# EAGLE schematic RGBtlc (EAGLE 6.2)
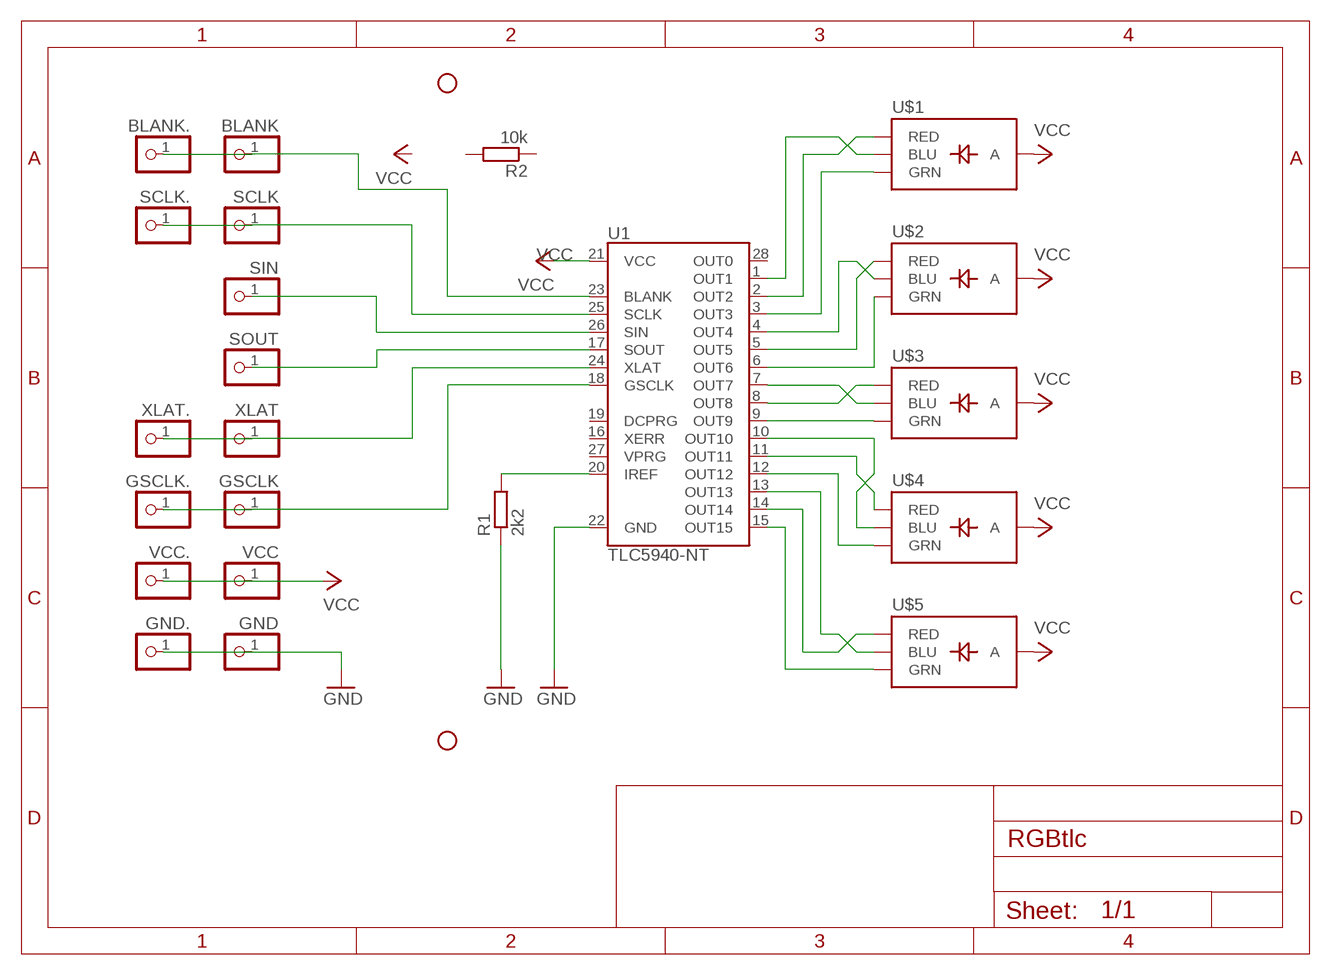
[diagram p0: schematic, sheet 1]

## Parts
BLANK  PINHD-1X1  [1X01]
BLANK.  PINHD-1X1  [1X01]
GND  PINHD-1X1  [1X01]
GND.  PINHD-1X1  [1X01]
GSCLK  PINHD-1X1  [1X01]
GSCLK.  PINHD-1X1  [1X01]
JP1  STAND-OFF  [STAND-OFF]
JP4  STAND-OFF  [STAND-OFF]
R1  2k2  R-EU_0207/7  [0207/7]
R2  10k  R-EU_0207/7  [0207/7]
SCLK  PINHD-1X1  [1X01]
SCLK.  PINHD-1X1  [1X01]
SIN  PINHD-1X1  [1X01]
SOUT  PINHD-1X1  [1X01]
U1  TLC5940-NT  [DIL28-3]
U$1  LED_PIRANHA_5MM  [LED_PIRANHA_5MM]
U$2  LED_PIRANHA_5MM  [LED_PIRANHA_5MM]
U$3  LED_PIRANHA_5MM  [LED_PIRANHA_5MM]
U$4  LED_PIRANHA_5MM  [LED_PIRANHA_5MM]
U$5  LED_PIRANHA_5MM  [LED_PIRANHA_5MM]
VCC  PINHD-1X1  [1X01]
VCC.  PINHD-1X1  [1X01]
XLAT  PINHD-1X1  [1X01]
XLAT.  PINHD-1X1  [1X01]

## Nets
GND: GND.1 GND..1 R1.1 U1.22(GND)
N$1: U1.15(OUT15) U$5.G(GRN)
N$2: U1.14(OUT14) U$5.R(RED)
N$3: U1.13(OUT13) U$5.B(BLU)
N$4: U1.7(OUT7) U$3.B(BLU)
N$5: U1.12(OUT12) U$4.G(GRN)
N$6: U1.11(OUT11) U$4.R(RED)
N$7: U1.10(OUT10) U$4.B(BLU)
N$8: U1.9(OUT9) U$3.G(GRN)
N$9: BLANK.1 BLANK..1 U1.23(BLANK)
N$11: U1.6(OUT6) U$2.G(GRN)
N$12: U1.5(OUT5) U$2.R(RED)
N$13: U1.4(OUT4) U$2.B(BLU)
N$14: U1.3(OUT3) U$1.G(GRN)
N$15: U1.2(OUT2) U$1.R(RED)
N$16: U1.1(OUT1) U$1.B(BLU)
N$17: SCLK.1 SCLK..1 U1.25(SCLK)
N$18: SIN.1 U1.26(SIN)
N$19: U1.24(XLAT) XLAT.1 XLAT..1
N$20: GSCLK.1 GSCLK..1 U1.18(GSCLK)
N$21: SOUT.1 U1.17(SOUT)
N$22: R1.2 U1.20(IREF)
N$23: U1.8(OUT8) U$3.R(RED)
VCC: U1.21(VCC) U$1.+(A) U$2.+(A) U$3.+(A) U$4.+(A) U$5.+(A) VCC.1 VCC..1
Unconnected: R2.1 R2.2 U1.16(XERR) U1.19(DCPRG) U1.27(VPRG) U1.28(OUT0)

## Library data of the parts
BLANK BLANK. GND GND. GSCLK GSCLK. SCLK SCLK. SIN SOUT VCC VCC. XLAT XLAT. = pinhead:PINHD-1X1: PIN HEADER
JP1 JP4 = SparkFun-Electromechanical:STAND-OFF: #4 Stand Off This is the mechanical footprint for a #4 phillips button head screw. Use the keepout ring to avoid running the screw head into surrounding components. SKU : PRT-00447
R1 R2 = rcl:R-EU_: RESISTOR, European symbol
U1 = SparkFun-DigitalIC:TLC5940: 16-channel LED Driver with Dot Correction and Grayscale PWM Control The TLC5940 is a 16-channel, constant-current sink LED driver. Each channel has an individually adjustable 4096-step grayscale PWM brightness control and a 64-step, constant-current sink (dot correction). The dot correction adjusts the brightness variations between LED channels and other LED drivers. The dot correction data is stored in an integrated EEPROM. Both grayscale control and dot correction are accessible via a serial interface. A single external resistor sets the maximum current value of all 16 channels. Packages: 28-pin HTSSOP 32-pin 5x5mm QFN 28-pin DIP
U$1-U$5 = jim:LED_PIRANHA_5MM: High-brightness RGB through-hole LED, similar to that used in the Shiftbrite